# EAGLE schematic RemoteTriggerTransmitter (EAGLE 5.11)
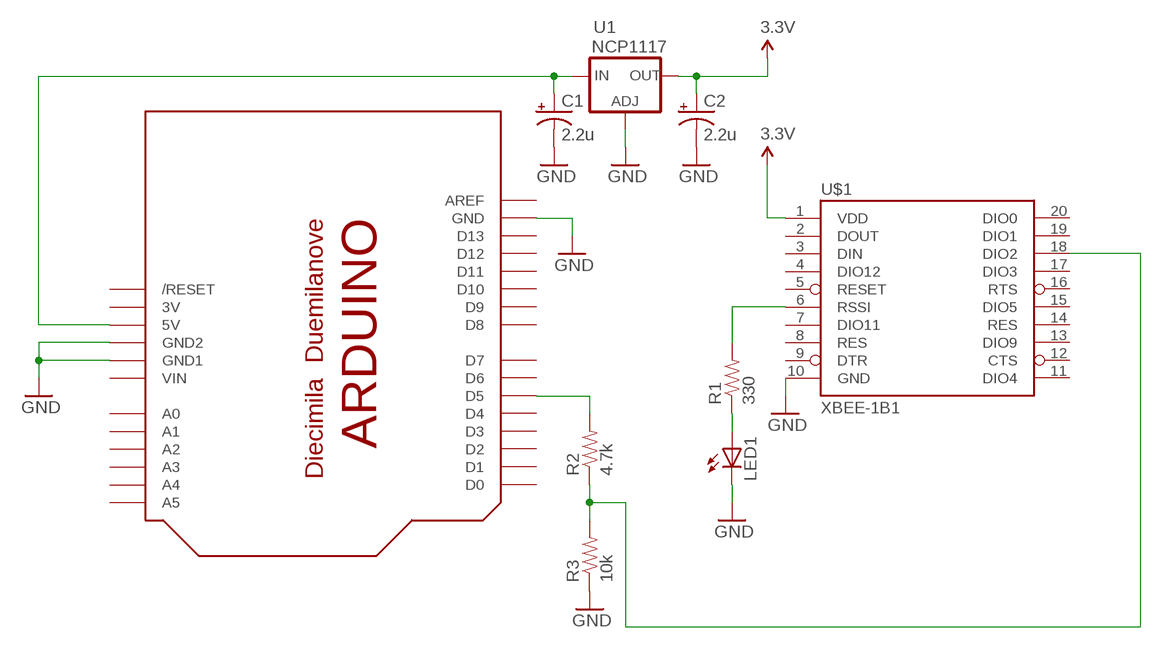
[diagram p0: schematic, sheet 1]

## Parts
C1  2.2u  CAP_POLPTH2  [CPOL-RADIAL-10UF-25V]
C2  2.2u  CAP_POLPTH2  [CPOL-RADIAL-10UF-25V]
LED1  LED5MM  [LED5MM]
R1  330  RESISTORAXIAL-0.3  [AXIAL-0.3]
R2  4.7k  RESISTORAXIAL-0.3  [AXIAL-0.3]
R3  10k  RESISTORAXIAL-0.3  [AXIAL-0.3]
U1  NCP1117  V_REG_317DPACK  [V-REG_DPACK]
U$1  XBEE-1B1  [XBEE-1]
U$2  ARDUINOUNO  [ARDUINO]

## Nets
3.3V: C2.1(+) U1.4(OUT) U$1.1(VDD)
GND: C1.2(-) C2.2(-) LED1.K(C) R3.P$1 U1.1(ADJ) U$1.10(GND) U$2.GND U$2.GND1 U$2.GND2
N$1: R2.P$2 U$2.D5
N$3: C1.1(+) U1.3(IN) U$2.5V
N$4: R1.P$2 U$1.6(RSSI)
N$5: LED1.A R1.P$1
N$6: R2.P$1 R3.P$2 U$1.18(DIO2)
Unconnected: U$1.2(DOUT) U$1.3(DIN) U$1.4(DIO12) U$1.5(RESET) U$1.7(DIO11) U$1.8(RES) U$1.9(DTR) U$1.11(DIO4) U$1.12(CTS) U$1.13(DIO9) U$1.14(RES) U$1.15(DIO5) U$1.16(RTS) U$1.17(DIO3) U$1.19(DIO1) U$1.20(DIO0) U$2.A0 U$2.A1 U$2.A2 U$2.A3 U$2.A4 U$2.A5 U$2.AREF U$2.D0 U$2.D1 U$2.D2 U$2.D3 U$2.D4 U$2.D6 U$2.D7 U$2.D8 U$2.D9 U$2.D10 U$2.D11 U$2.D12 U$2.D13 U$2.RESET(/RESET)

## Power pins joined to a net without a drawn wire
3V: U$2.3V
VIN: U$2.VIN

## Library data of the parts
C1 C2 = SparkFun-20110517:CAP_POL: Capacitor Polarized These are standard SMD and PTH capacitors. Normally 10uF, 47uF, and 100uF in electrolytic and tantalum varieties. Always verify the external diameter of the through hole cap, it varies with capacity, voltage, and manufacturer. The EIA devices should be standard.
LED1 = SparkFun-20110517:LED: LEDs Standard schematic elements and footprints for 5mm, 3mm, 1206, and 0603 sized LEDs. 5mm - Spark Fun Electronics SKU : COM-00529 (and others)
R1-R3 = SparkFun-20110517:RESISTOR: Resistor Basic schematic elements and footprints for 0603, 1206, and PTH resistors.
U1 = SparkFun-20110517:V_REG_317: Voltage Regulator Standard LM317 adjustable voltage regulator. AOI (Adjust Output Input). Google 'LM317 Calculator' for easy to use app to get the two resistor values needed. 240/720 for 5V output. 240/390 for 3.3V output. Spark Fun Electronics SKU : COM-00527
U$1 = SparkFun-20110517:XBEE-1
U$2 = adafruit:ARDUINO: Arduino Diecimila/Duemilanove Make a shield with ease, this package has all the named pins as well as the two mounting drill holes and an outline of the USB and DC power connector. The outline is on the DIMENSION layer, so if your board house uses it they will cut the outline to match. http://www.ladyada.net/library/pcb/eaglelibrary.html